# Altium schematic sheet Input.SchDoc: ThunderScope 1000E
size A4; DrawnBy: Aleksa Bjelogrlic; Revision: 1
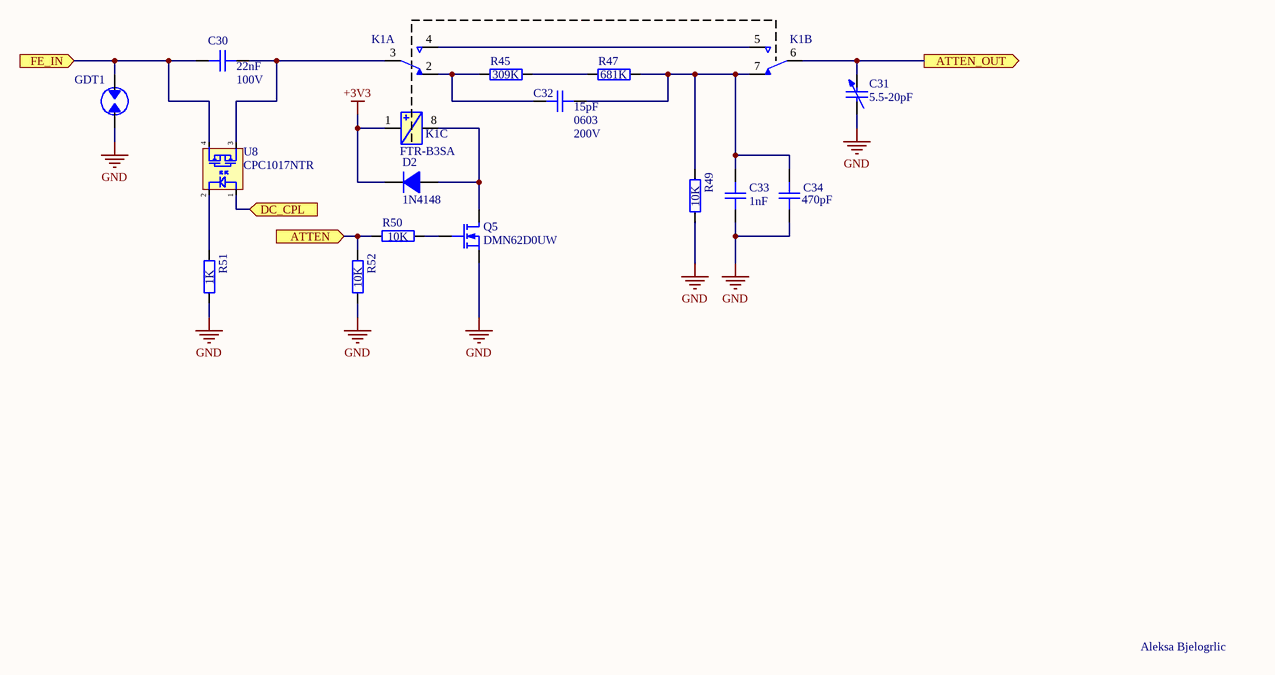
[diagram p0: Input.SchDoc]

## Parts
C30  22nF  Voltage Rating: 100V  [GEN_C_0603]
C31  5.5-20pF  [EW_TRIMCAP]
C32  15pF  Package: 0603  Voltage Rating: 200V  [GEN_C_0603]
C33  1nF  [GEN_C_0402]
C34  470pF  [GEN_C_0402]
D2  1N4148  [GEN_SOD_323]
GDT1  GDT  [BOU_2051]  (value not drawn)
K1  FTR-B3SA  [FUJ_FTR-B3SA]  (value not drawn)  (parts A,B,C of 3)
Q5  DMN62D0UW  [GEN_SOT_323]
R45  309K  [GEN_R_0402]
R47  681K  [GEN_R_0402]
R49  10K  [GEN_R_0402]
R50  10K  [GEN_R_0402]
R51  1K  [GEN_R_0402]
R52  10K  [GEN_R_0402]
U8  CPC1017NTR  [IXY_CPC1017]

## Ports
ATTEN (in), ATTEN_OUT (out), DC_CPL (in), FE_IN (in)

## Nets
+3V3: D2.1(K) K1.1
GND: C31.2 C33.1 C34.1 GDT1.2 Q5.3(S) R49.1 R51.1 R52.1
ATTEN: R50.2 R52.2 ; port ATTEN
ATTEN_OUT: C31.1 K1.6 ; port ATTEN_OUT
DC_CPL: U8.1 ; port DC_CPL
FE_IN: C30.2 GDT1.1 U8.4 ; port FE_IN
NetC30_1: C30.1 K1.3 U8.3
NetC32_1: C32.1 C33.2 C34.2 K1.7 R47.2 R49.2
NetC32_2: C32.2 K1.2 R45.1
NetD2_2: D2.2(A) K1.8 Q5.1(D)
NetK1_4: K1.4 K1.5
NetQ5_2: Q5.2(G) R50.1
NetR45_2: R45.2 R47.1
NetR51_2: R51.2 U8.2

## Notes on the sheet
- Aleksa Bjelogrlic

## Library data of the parts
C30 = CAP 22nF 100V X7R 0603: Package: 0603; Supplier 1: Digi-Key; Supplier Part Number 1: 490-4782-1-ND; Value: 22nF
C31 = CAP TRIMMER 5.5-20PF 500V: Value: 5.5-20pF; Supplier 1: Digikey; Supplier Part Number 1: 2447-SGC3S200NMCT-ND
C32 = CAP 15pF 200V C0G 0603: Supplier 1: Digi-Key; Supplier Part Number 1: 478-10254-1-ND; Value: 15pF
C33 = CAP 1nF 50V C0G 0402: Voltage Rating: 50V; Package: 0402; Supplier 1: Digi-Key; Supplier Part Number 1: 490-6189-1-ND; Value: 1nF
C34 = CAP 470pF 50V C0G 0402: Voltage Rating: 50V; Temperature Coefficient: C0G; Package: 0402; Supplier 1: Digi-Key; Supplier Part Number 1: 490-8207-1-ND; Value: 470pF
D2 = DIODE 1N4148: Max Reverse Voltage: 75V; Max Current: 150mA; Supplier 1: Digi-Key; Supplier Part Number 1: 1N4148WS-FDICT-ND
GDT1 = GDT 90V: Supplier 1: Digi-Key; Supplier Part Number 1: 2051-09-SM-RPLFCT-ND
K1 = RELAY DPDT-NO FTR-B3SA: Supplier 1: Mouser; Supplier Part Number 1: 817-FTR-B3SA003Z
Q5 = NMOS DMN62D0UW: Vdss: 60V; Id: 340mA; Max Power: 320mW; Supplier 1: Digi-Key; Supplier Part Number 1: DMN62D0UW-7DICT-ND
R45 = RES 309K OHM 1% 1/16W 0402: Tolerance: 1%; Power Rating: 0.0625W; Package: 0402; Supplier 1: Digi-Key; Supplier Part Number 1: YAG3108CT-ND; Value: 309K
R47 = RES 681K OHM 1% 1/16W 0402: Tolerance: 1%; Power Rating: 0.0625W; Package: 0402; Supplier 1: Digi-Key; Supplier Part Number 1: YAG3212CT-ND; Value: 681K
R49 R50 R52 = RES 10K OHM 1% 1/10W 0402: Tolerance: 1%; Power Rating: 0.1W; Package: 0402; Supplier 1: Digi-Key; Supplier Part Number 1: P10.0KLCT-ND; Value: 10K
R51 = RES 1K OHM 1% 1/10W 0402: Tolerance: 1%; Power Rating: 0.1W; Package: 0402; Supplier 1: Digi-Key; Supplier Part Number 1: 311-1.00KLRCT-ND; Value: 1K
U8 = SSR CPC1017NTR: Supplier 1: Digi-Key; Supplier Part Number 1: CLA233CT-ND